# Altium schematic sheet JETSON AGX CONNECTOR TOP SHEET.SchDoc: Jetson AGX Connector
size B; Engineer: Cindy Li, Chealsie Bains; Organization: UW Robotics; Address1: 200 University Avenue; Address2: Waterloo; Address3: Ontario; Address4: Canada N2L 3G6; DocumentNumber: 3; Revision: 1; SheetNumber: 3; SheetTotal: 12
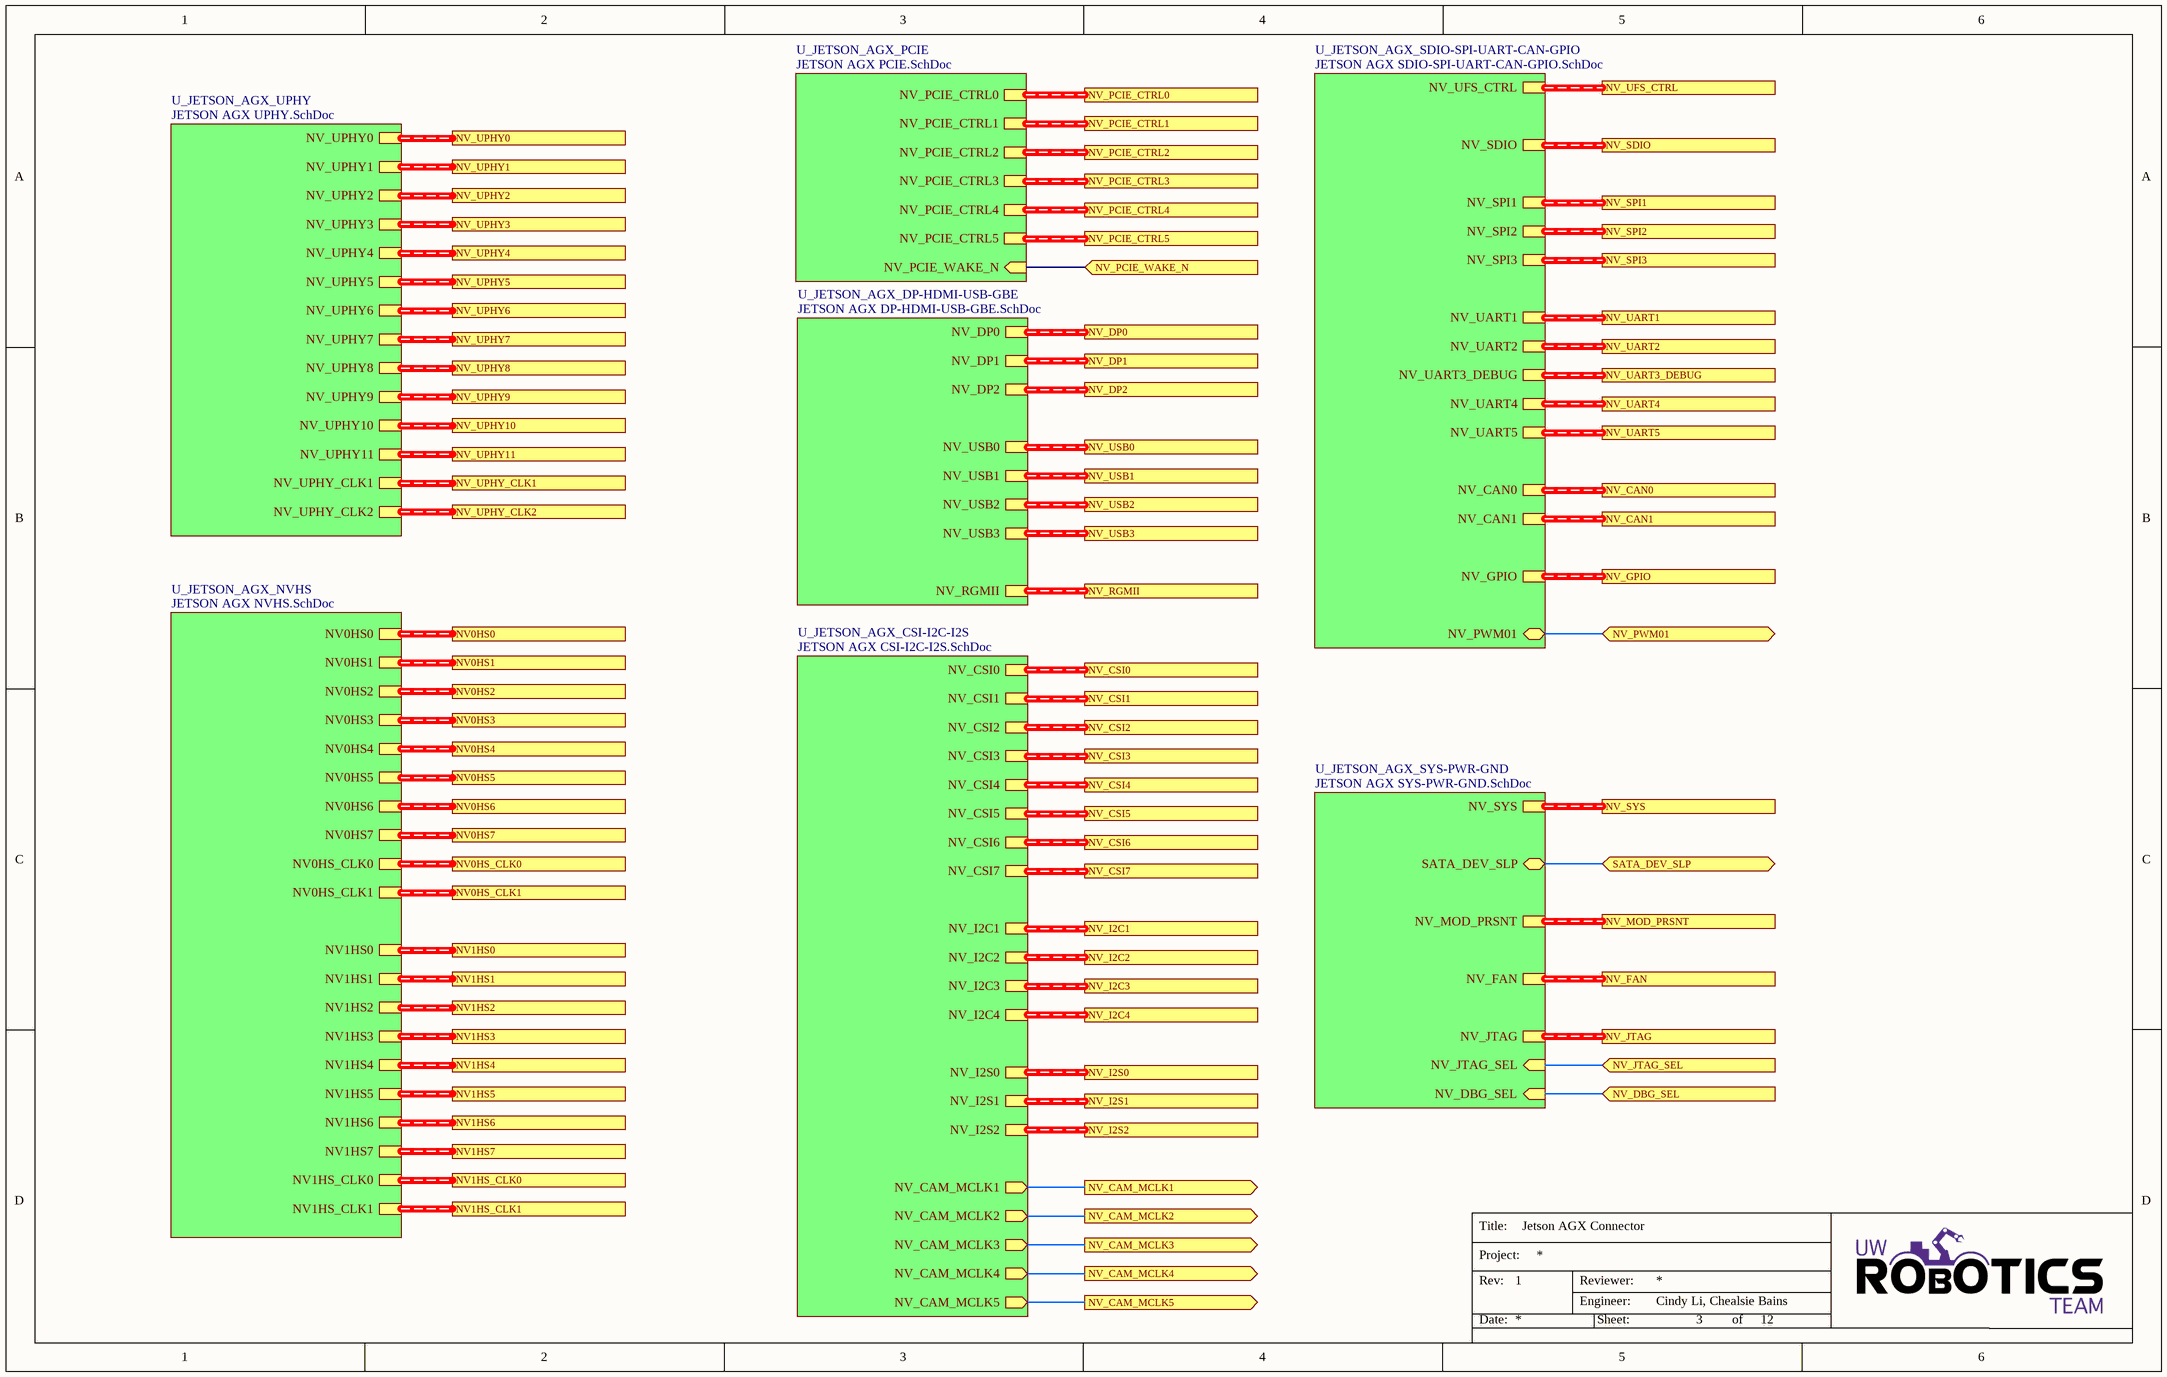
[diagram p0: JETSON AGX CONNECTOR TOP SHEET.SchDoc]

## Sub-sheets
U_JETSON_AGX_CSI-I2C-I2S = JETSON AGX CSI-I2C-I2S.SchDoc: NV_CSI0 (harness CSI_X2), NV_CSI1 (harness CSI_X2), NV_CSI2 (harness CSI_X2), NV_CSI3 (harness CSI_X2), NV_CSI4 (harness CSI_X2), NV_CSI5 (harness CSI_X2), NV_CSI6 (harness CSI_X2), NV_CSI7 (harness CSI_X2), NV_I2C1 (harness I2C), NV_I2C2 (harness I2C), NV_I2C3 (harness I2C), NV_I2C4 (harness I2C), NV_I2S1 (harness I2S), NV_I2S0 (harness I2S), NV_I2S2 (harness I2S), NV_CAM_MCLK1 (out), NV_CAM_MCLK2 (out), NV_CAM_MCLK3 (out), NV_CAM_MCLK4 (out), NV_CAM_MCLK5 (out)
U_JETSON_AGX_DP-HDMI-USB-GBE = JETSON AGX DP-HDMI-USB-GBE.SchDoc: NV_DP0 (harness DISPLAYPORT), NV_DP1 (harness DISPLAYPORT), NV_DP2 (harness DISPLAYPORT), NV_USB0 (harness USB2), NV_USB1 (harness USB2), NV_USB2 (harness USB2), NV_USB3 (harness USB2), NV_RGMII (harness RGMII)
U_JETSON_AGX_NVHS = JETSON AGX NVHS.SchDoc: NV0HS0 (harness NVHS), NV0HS1 (harness NVHS), NV0HS2 (harness NVHS), NV0HS3 (harness NVHS), NV0HS4 (harness NVHS), NV0HS5 (harness NVHS), NV0HS6 (harness NVHS), NV0HS7 (harness NVHS), NV0HS_CLK0 (harness NVHS_CLK), NV0HS_CLK1 (harness NVHS_CLK), NV1HS0 (harness NVHS), NV1HS_CLK0 (harness NVHS_CLK), NV1HS1 (harness NVHS), NV1HS2 (harness NVHS), NV1HS3 (harness NVHS), NV1HS4 (harness NVHS), NV1HS5 (harness NVHS), NV1HS6 (harness NVHS), NV1HS7 (harness NVHS), NV1HS_CLK1 (harness NVHS_CLK)
U_JETSON_AGX_PCIE = JETSON AGX PCIE.SchDoc: NV_PCIE_CTRL0 (harness PCIE_CTRL), NV_PCIE_CTRL1 (harness PCIE_CTRL), NV_PCIE_CTRL2 (harness PCIE_CTRL), NV_PCIE_CTRL3 (harness PCIE_CTRL), NV_PCIE_CTRL4 (harness PCIE_CTRL), NV_PCIE_CTRL5 (harness PCIE_CTRL), NV_PCIE_WAKE_N (in)
U_JETSON_AGX_SDIO-SPI-UART-CAN-GPIO = JETSON AGX SDIO-SPI-UART-CAN-GPIO.SchDoc: NV_SDIO (harness SDIO), NV_SPI1 (harness SPI), NV_SPI2 (harness SPI), NV_SPI3 (harness SPI), NV_UFS_CTRL (harness UFS_CTRL), NV_UART1 (harness UART_5-W), NV_UART3_DEBUG (harness UART_3-W), NV_UART2 (harness UART_5-W), NV_UART4 (harness UART_5-W), NV_UART5 (harness UART_5-W), NV_CAN0 (harness CAN), NV_CAN1 (harness CAN), NV_PWM01 (bidir), NV_GPIO (harness NV_GPIO)
U_JETSON_AGX_SYS-PWR-GND = JETSON AGX SYS-PWR-GND.SchDoc: NV_JTAG (harness NV_JTAG), NV_JTAG_SEL (in), NV_DBG_SEL (in), NV_FAN (harness FAN), NV_SYS (harness NV_SYS), SATA_DEV_SLP (bidir), NV_MOD_PRSNT (harness MOD_PRSNT)
U_JETSON_AGX_UPHY = JETSON AGX UPHY.SchDoc: NV_UPHY0 (harness UPHY), NV_UPHY1 (harness UPHY), NV_UPHY2 (harness UPHY), NV_UPHY3 (harness UPHY), NV_UPHY4 (harness UPHY), NV_UPHY5 (harness UPHY), NV_UPHY6 (harness UPHY), NV_UPHY7 (harness UPHY), NV_UPHY8 (harness UPHY), NV_UPHY9 (harness UPHY), NV_UPHY10 (harness UPHY), NV_UPHY11 (harness UPHY), NV_UPHY_CLK1 (harness UPHY_CLK), NV_UPHY_CLK2 (harness UPHY_CLK)

## Ports
NV0HS0 (harness NVHS), NV0HS1 (harness NVHS), NV0HS2 (harness NVHS), NV0HS3 (harness NVHS), NV0HS4 (harness NVHS), NV0HS5 (harness NVHS), NV0HS6 (harness NVHS), NV0HS7 (harness NVHS), NV0HS_CLK0 (harness NVHS_CLK), NV0HS_CLK1 (harness NVHS_CLK), NV1HS0 (harness NVHS), NV1HS1 (harness NVHS), NV1HS2 (harness NVHS), NV1HS3 (harness NVHS), NV1HS4 (harness NVHS), NV1HS5 (harness NVHS), NV1HS6 (harness NVHS), NV1HS7 (harness NVHS), NV1HS_CLK0 (harness NVHS_CLK), NV1HS_CLK1 (harness NVHS_CLK), NV_CAM_MCLK1 (out), NV_CAM_MCLK2 (out), NV_CAM_MCLK3 (out), NV_CAM_MCLK4 (out), NV_CAM_MCLK5 (out), NV_CAN0 (harness CAN), NV_CAN1 (harness CAN), NV_CSI0 (harness CSI_X2), NV_CSI1 (harness CSI_X2), NV_CSI2 (harness CSI_X2), NV_CSI3 (harness CSI_X2), NV_CSI4 (harness CSI_X2), NV_CSI5 (harness CSI_X2), NV_CSI6 (harness CSI_X2), NV_CSI7 (harness CSI_X2), NV_DBG_SEL (in), NV_DP0 (harness DISPLAYPORT), NV_DP1 (harness DISPLAYPORT), NV_DP2 (harness DISPLAYPORT), NV_FAN (harness FAN), NV_GPIO (harness NV_GPIO), NV_I2C1 (harness I2C), NV_I2C2 (harness I2C), NV_I2C3 (harness I2C), NV_I2C4 (harness I2C), NV_I2S0 (harness I2S), NV_I2S1 (harness I2S), NV_I2S2 (harness I2S), NV_JTAG (harness NV_JTAG), NV_JTAG_SEL (in), NV_MOD_PRSNT (harness MOD_PRSNT), NV_PCIE_CTRL0 (harness PCIE_CTRL), NV_PCIE_CTRL1 (harness PCIE_CTRL), NV_PCIE_CTRL2 (harness PCIE_CTRL), NV_PCIE_CTRL3 (harness PCIE_CTRL), NV_PCIE_CTRL4 (harness PCIE_CTRL), NV_PCIE_CTRL5 (harness PCIE_CTRL), NV_PCIE_WAKE_N (in), NV_PWM01 (bidir), NV_RGMII (harness RGMII), NV_SDIO (harness SDIO), NV_SPI1 (harness SPI), NV_SPI2 (harness SPI), NV_SPI3 (harness SPI), NV_SYS (harness NV_SYS), NV_UART1 (harness UART_5-W), NV_UART2 (harness UART_5-W), NV_UART3_DEBUG (harness UART_3-W), NV_UART4 (harness UART_5-W), NV_UART5 (harness UART_5-W), NV_UFS_CTRL (harness UFS_CTRL), NV_UPHY0 (harness UPHY), NV_UPHY1 (harness UPHY), NV_UPHY2 (harness UPHY), NV_UPHY3 (harness UPHY), NV_UPHY4 (harness UPHY), NV_UPHY5 (harness UPHY), NV_UPHY6 (harness UPHY), NV_UPHY7 (harness UPHY), NV_UPHY8 (harness UPHY), NV_UPHY9 (harness UPHY), NV_UPHY10 (harness UPHY), NV_UPHY11 (harness UPHY), NV_UPHY_CLK1 (harness UPHY_CLK), NV_UPHY_CLK2 (harness UPHY_CLK), NV_USB0 (harness USB2), NV_USB1 (harness USB2), NV_USB2 (harness USB2), NV_USB3 (harness USB2), SATA_DEV_SLP (bidir)

## Nets
NV_CAM_MCLK1: port NV_CAM_MCLK1, sheet U_JETSON_AGX_CSI-I2C-I2S/NV_CAM_MCLK1
NV_CAM_MCLK2: port NV_CAM_MCLK2, sheet U_JETSON_AGX_CSI-I2C-I2S/NV_CAM_MCLK2
NV_CAM_MCLK3: port NV_CAM_MCLK3, sheet U_JETSON_AGX_CSI-I2C-I2S/NV_CAM_MCLK3
NV_CAM_MCLK4: port NV_CAM_MCLK4, sheet U_JETSON_AGX_CSI-I2C-I2S/NV_CAM_MCLK4
NV_CAM_MCLK5: port NV_CAM_MCLK5, sheet U_JETSON_AGX_CSI-I2C-I2S/NV_CAM_MCLK5
NV_DBG_SEL: port NV_DBG_SEL, sheet U_JETSON_AGX_SYS-PWR-GND/NV_DBG_SEL
NV_JTAG_SEL: port NV_JTAG_SEL, sheet U_JETSON_AGX_SYS-PWR-GND/NV_JTAG_SEL
NV_PCIE_WAKE_N: port NV_PCIE_WAKE_N, sheet U_JETSON_AGX_PCIE/NV_PCIE_WAKE_N
NV_PWM01: port NV_PWM01, sheet U_JETSON_AGX_SDIO-SPI-UART-CAN-GPIO/NV_PWM01
SATA_DEV_SLP: port SATA_DEV_SLP, sheet U_JETSON_AGX_SYS-PWR-GND/SATA_DEV_SLP

## Buses and harness runs
harness port NV0HS0 = sheet U_JETSON_AGX_NVHS/NV0HS0
harness port NV0HS1 = sheet U_JETSON_AGX_NVHS/NV0HS1
harness port NV0HS2 = sheet U_JETSON_AGX_NVHS/NV0HS2
harness port NV0HS3 = sheet U_JETSON_AGX_NVHS/NV0HS3
harness port NV0HS4 = sheet U_JETSON_AGX_NVHS/NV0HS4
harness port NV0HS5 = sheet U_JETSON_AGX_NVHS/NV0HS5
harness port NV0HS6 = sheet U_JETSON_AGX_NVHS/NV0HS6
harness port NV0HS7 = sheet U_JETSON_AGX_NVHS/NV0HS7
harness port NV0HS_CLK0 = sheet U_JETSON_AGX_NVHS/NV0HS_CLK0
harness port NV0HS_CLK1 = sheet U_JETSON_AGX_NVHS/NV0HS_CLK1
harness port NV1HS0 = sheet U_JETSON_AGX_NVHS/NV1HS0
harness port NV1HS1 = sheet U_JETSON_AGX_NVHS/NV1HS1
harness port NV1HS2 = sheet U_JETSON_AGX_NVHS/NV1HS2
harness port NV1HS3 = sheet U_JETSON_AGX_NVHS/NV1HS3
harness port NV1HS4 = sheet U_JETSON_AGX_NVHS/NV1HS4
harness port NV1HS5 = sheet U_JETSON_AGX_NVHS/NV1HS5
harness port NV1HS6 = sheet U_JETSON_AGX_NVHS/NV1HS6
harness port NV1HS7 = sheet U_JETSON_AGX_NVHS/NV1HS7
harness port NV1HS_CLK0 = sheet U_JETSON_AGX_NVHS/NV1HS_CLK0
harness port NV1HS_CLK1 = sheet U_JETSON_AGX_NVHS/NV1HS_CLK1
harness port NV_CAN0 = sheet U_JETSON_AGX_SDIO-SPI-UART-CAN-GPIO/NV_CAN0
harness port NV_CAN1 = sheet U_JETSON_AGX_SDIO-SPI-UART-CAN-GPIO/NV_CAN1
harness port NV_CSI0 = sheet U_JETSON_AGX_CSI-I2C-I2S/NV_CSI0
harness port NV_CSI1 = sheet U_JETSON_AGX_CSI-I2C-I2S/NV_CSI1
harness port NV_CSI2 = sheet U_JETSON_AGX_CSI-I2C-I2S/NV_CSI2
harness port NV_CSI3 = sheet U_JETSON_AGX_CSI-I2C-I2S/NV_CSI3
harness port NV_CSI4 = sheet U_JETSON_AGX_CSI-I2C-I2S/NV_CSI4
harness port NV_CSI5 = sheet U_JETSON_AGX_CSI-I2C-I2S/NV_CSI5
harness port NV_CSI6 = sheet U_JETSON_AGX_CSI-I2C-I2S/NV_CSI6
harness port NV_CSI7 = sheet U_JETSON_AGX_CSI-I2C-I2S/NV_CSI7
harness port NV_DP0 = sheet U_JETSON_AGX_DP-HDMI-USB-GBE/NV_DP0
harness port NV_DP1 = sheet U_JETSON_AGX_DP-HDMI-USB-GBE/NV_DP1
harness port NV_DP2 = sheet U_JETSON_AGX_DP-HDMI-USB-GBE/NV_DP2
harness port NV_FAN = sheet U_JETSON_AGX_SYS-PWR-GND/NV_FAN
harness port NV_GPIO = sheet U_JETSON_AGX_SDIO-SPI-UART-CAN-GPIO/NV_GPIO
harness port NV_I2C1 = sheet U_JETSON_AGX_CSI-I2C-I2S/NV_I2C1
harness port NV_I2C2 = sheet U_JETSON_AGX_CSI-I2C-I2S/NV_I2C2
harness port NV_I2C3 = sheet U_JETSON_AGX_CSI-I2C-I2S/NV_I2C3
harness port NV_I2C4 = sheet U_JETSON_AGX_CSI-I2C-I2S/NV_I2C4
harness port NV_I2S0 = sheet U_JETSON_AGX_CSI-I2C-I2S/NV_I2S0
harness port NV_I2S1 = sheet U_JETSON_AGX_CSI-I2C-I2S/NV_I2S1
harness port NV_I2S2 = sheet U_JETSON_AGX_CSI-I2C-I2S/NV_I2S2
harness port NV_JTAG = sheet U_JETSON_AGX_SYS-PWR-GND/NV_JTAG
harness port NV_MOD_PRSNT = sheet U_JETSON_AGX_SYS-PWR-GND/NV_MOD_PRSNT
harness port NV_PCIE_CTRL0 = sheet U_JETSON_AGX_PCIE/NV_PCIE_CTRL0
harness port NV_PCIE_CTRL1 = sheet U_JETSON_AGX_PCIE/NV_PCIE_CTRL1
harness port NV_PCIE_CTRL2 = sheet U_JETSON_AGX_PCIE/NV_PCIE_CTRL2
harness port NV_PCIE_CTRL3 = sheet U_JETSON_AGX_PCIE/NV_PCIE_CTRL3
harness port NV_PCIE_CTRL4 = sheet U_JETSON_AGX_PCIE/NV_PCIE_CTRL4
harness port NV_PCIE_CTRL5 = sheet U_JETSON_AGX_PCIE/NV_PCIE_CTRL5
harness port NV_RGMII = sheet U_JETSON_AGX_DP-HDMI-USB-GBE/NV_RGMII
harness port NV_SDIO = sheet U_JETSON_AGX_SDIO-SPI-UART-CAN-GPIO/NV_SDIO
harness port NV_SPI1 = sheet U_JETSON_AGX_SDIO-SPI-UART-CAN-GPIO/NV_SPI1
harness port NV_SPI2 = sheet U_JETSON_AGX_SDIO-SPI-UART-CAN-GPIO/NV_SPI2
harness port NV_SPI3 = sheet U_JETSON_AGX_SDIO-SPI-UART-CAN-GPIO/NV_SPI3
harness port NV_SYS = sheet U_JETSON_AGX_SYS-PWR-GND/NV_SYS
harness port NV_UART1 = sheet U_JETSON_AGX_SDIO-SPI-UART-CAN-GPIO/NV_UART1
harness port NV_UART2 = sheet U_JETSON_AGX_SDIO-SPI-UART-CAN-GPIO/NV_UART2
harness port NV_UART3_DEBUG = sheet U_JETSON_AGX_SDIO-SPI-UART-CAN-GPIO/NV_UART3_DEBUG
harness port NV_UART4 = sheet U_JETSON_AGX_SDIO-SPI-UART-CAN-GPIO/NV_UART4
harness port NV_UART5 = sheet U_JETSON_AGX_SDIO-SPI-UART-CAN-GPIO/NV_UART5
harness port NV_UFS_CTRL = sheet U_JETSON_AGX_SDIO-SPI-UART-CAN-GPIO/NV_UFS_CTRL
harness port NV_UPHY0 = sheet U_JETSON_AGX_UPHY/NV_UPHY0
harness port NV_UPHY1 = sheet U_JETSON_AGX_UPHY/NV_UPHY1
harness port NV_UPHY2 = sheet U_JETSON_AGX_UPHY/NV_UPHY2
harness port NV_UPHY3 = sheet U_JETSON_AGX_UPHY/NV_UPHY3
harness port NV_UPHY4 = sheet U_JETSON_AGX_UPHY/NV_UPHY4
harness port NV_UPHY5 = sheet U_JETSON_AGX_UPHY/NV_UPHY5
harness port NV_UPHY6 = sheet U_JETSON_AGX_UPHY/NV_UPHY6
harness port NV_UPHY7 = sheet U_JETSON_AGX_UPHY/NV_UPHY7
harness port NV_UPHY8 = sheet U_JETSON_AGX_UPHY/NV_UPHY8
harness port NV_UPHY9 = sheet U_JETSON_AGX_UPHY/NV_UPHY9
harness port NV_UPHY10 = sheet U_JETSON_AGX_UPHY/NV_UPHY10
harness port NV_UPHY11 = sheet U_JETSON_AGX_UPHY/NV_UPHY11
harness port NV_UPHY_CLK1 = sheet U_JETSON_AGX_UPHY/NV_UPHY_CLK1
harness port NV_UPHY_CLK2 = sheet U_JETSON_AGX_UPHY/NV_UPHY_CLK2
harness port NV_USB0 = sheet U_JETSON_AGX_DP-HDMI-USB-GBE/NV_USB0
harness port NV_USB1 = sheet U_JETSON_AGX_DP-HDMI-USB-GBE/NV_USB1
harness port NV_USB2 = sheet U_JETSON_AGX_DP-HDMI-USB-GBE/NV_USB2
harness port NV_USB3 = sheet U_JETSON_AGX_DP-HDMI-USB-GBE/NV_USB3

## Notes on the sheet
- Title:
- Project:
- Date:
- Rev:
- Reviewer:
- Engineer:
- Sheet:
- of